# EasyEDA Pro project ProPrj_NFC Buisness card_2026-06-10_16-38-08_2026-06-10.epro

# Schematic NFC Buisness card
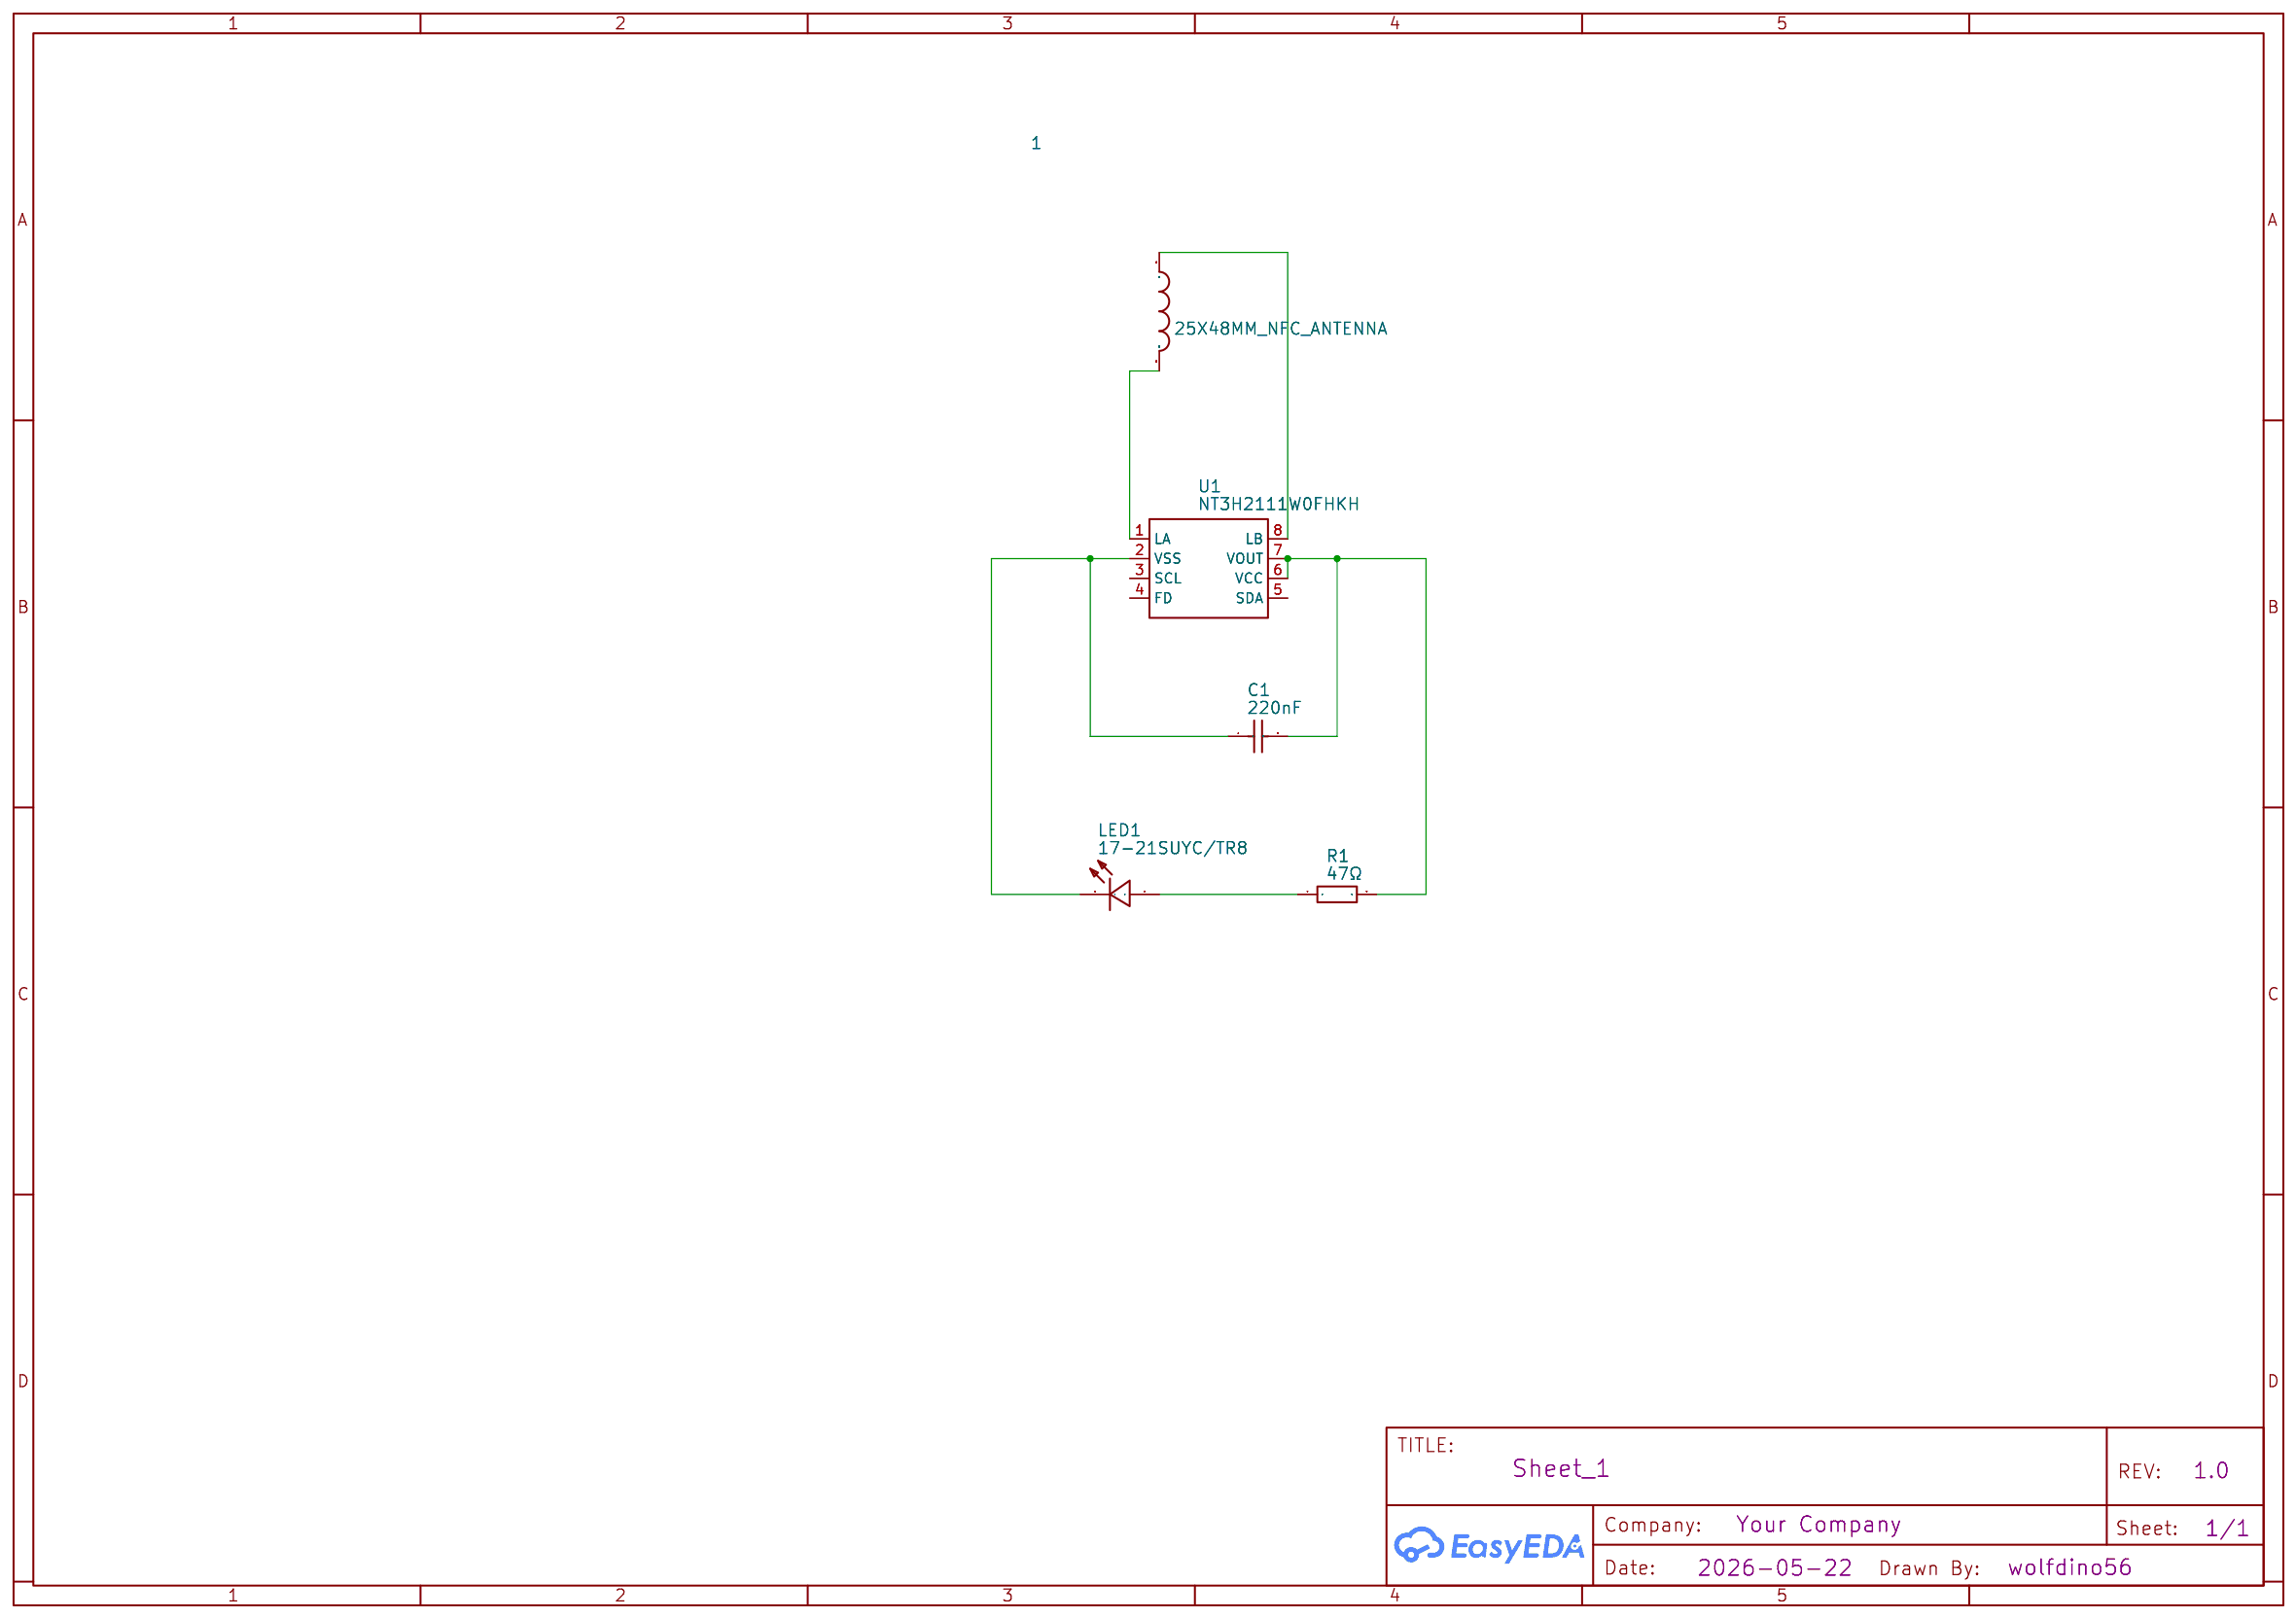
[diagram p0: schematic sheet]

## Parts
1  25X48MM_NFC_ANTENNA  [25X48MM_NFC_ANTENNA]
C1  220nF  [C0603]
LED1  17-21SUYC/TR8  [LED0805-R-RD]
R1  47Ω  [R0603]
U1  NT3H2111W0FHKH  [XQFN-8_L1.6-W1.6-P0.50-BL_NT3H2111W0FHKH]

## Library data of the parts
1 = 25X48MM_NFC_ANTENNA
C1 = CL10B224KA8NNNC: Supplier: LCSC; Manufacturer: SAMSUNG(三星); Supplier Part: C21120; JLCPCB Part Class: Basic Part; Origin 3D Model Title: C0603_L1.6-W0.8-H0.8
LED1 = KT-0805黄灯: Supplier: LCSC; Manufacturer: KENTO; Supplier Part: C2296; JLCPCB Part Class: Basic Part; Origin 3D Model Title: LED0805-RD
R1 = 0603WAF470JT5E: Supplier: LCSC; Manufacturer: UNI-ROYAL(厚声); Supplier Part: C23182; JLCPCB Part Class: Basic Part
U1 = NT3H2111W0FHKH: Supplier: LCSC; Supplier Part: C710403; Manufacturer: NXP(恩智浦); JLCPCB Part Class: Extended Part

## Nets
LED1_1: LED1.1(+) R1.1
U1_1: 1.P$2 U1.1(LA)
U1_2: C1.1 LED1.2(-) U1.2(VSS)
U1_6: C1.2 R1.2 U1.6(VCC) U1.7(VOUT)
U1_8: 1.P$1 U1.8(LB)

Not connected (* = marked no-connect by the designer): U1 3(SCL) 4(FD) 5(SDA)

# Board PCB_NFC Buisness card
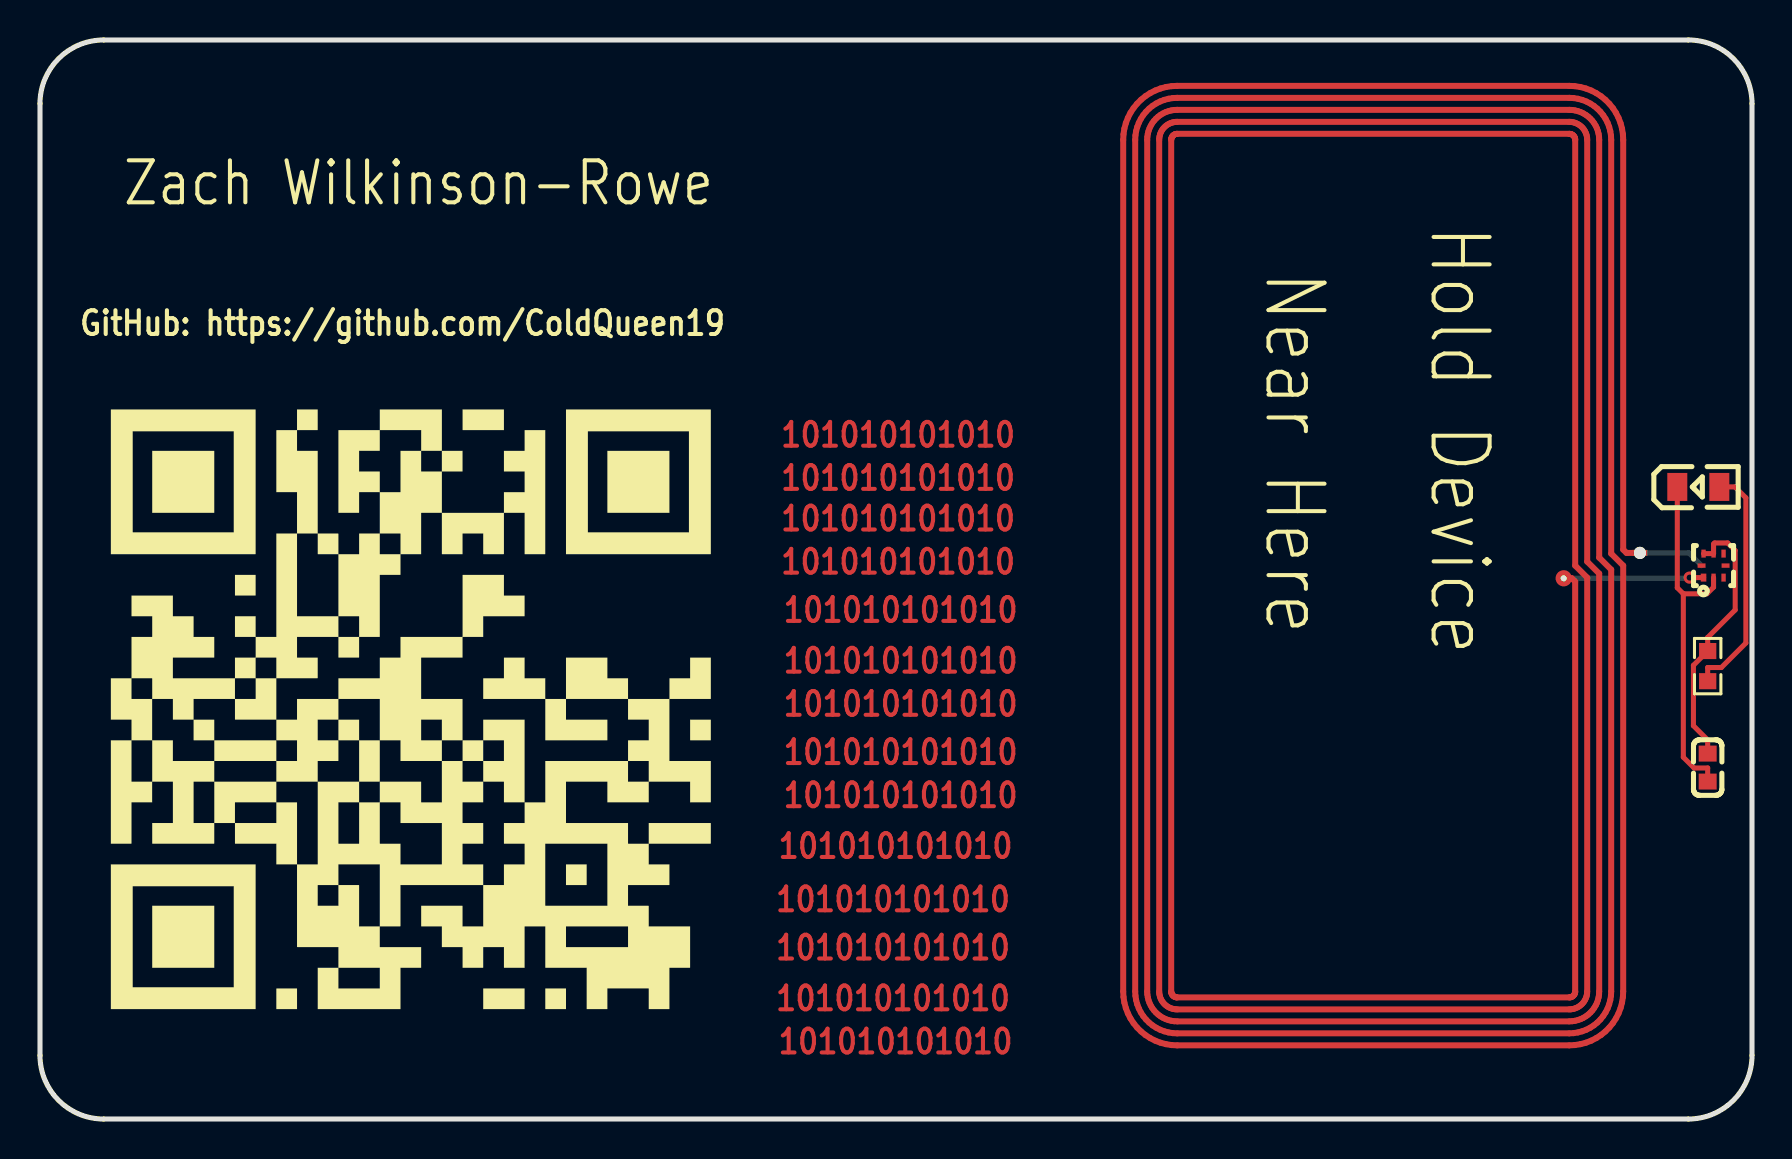
[diagram p1: board, top side]
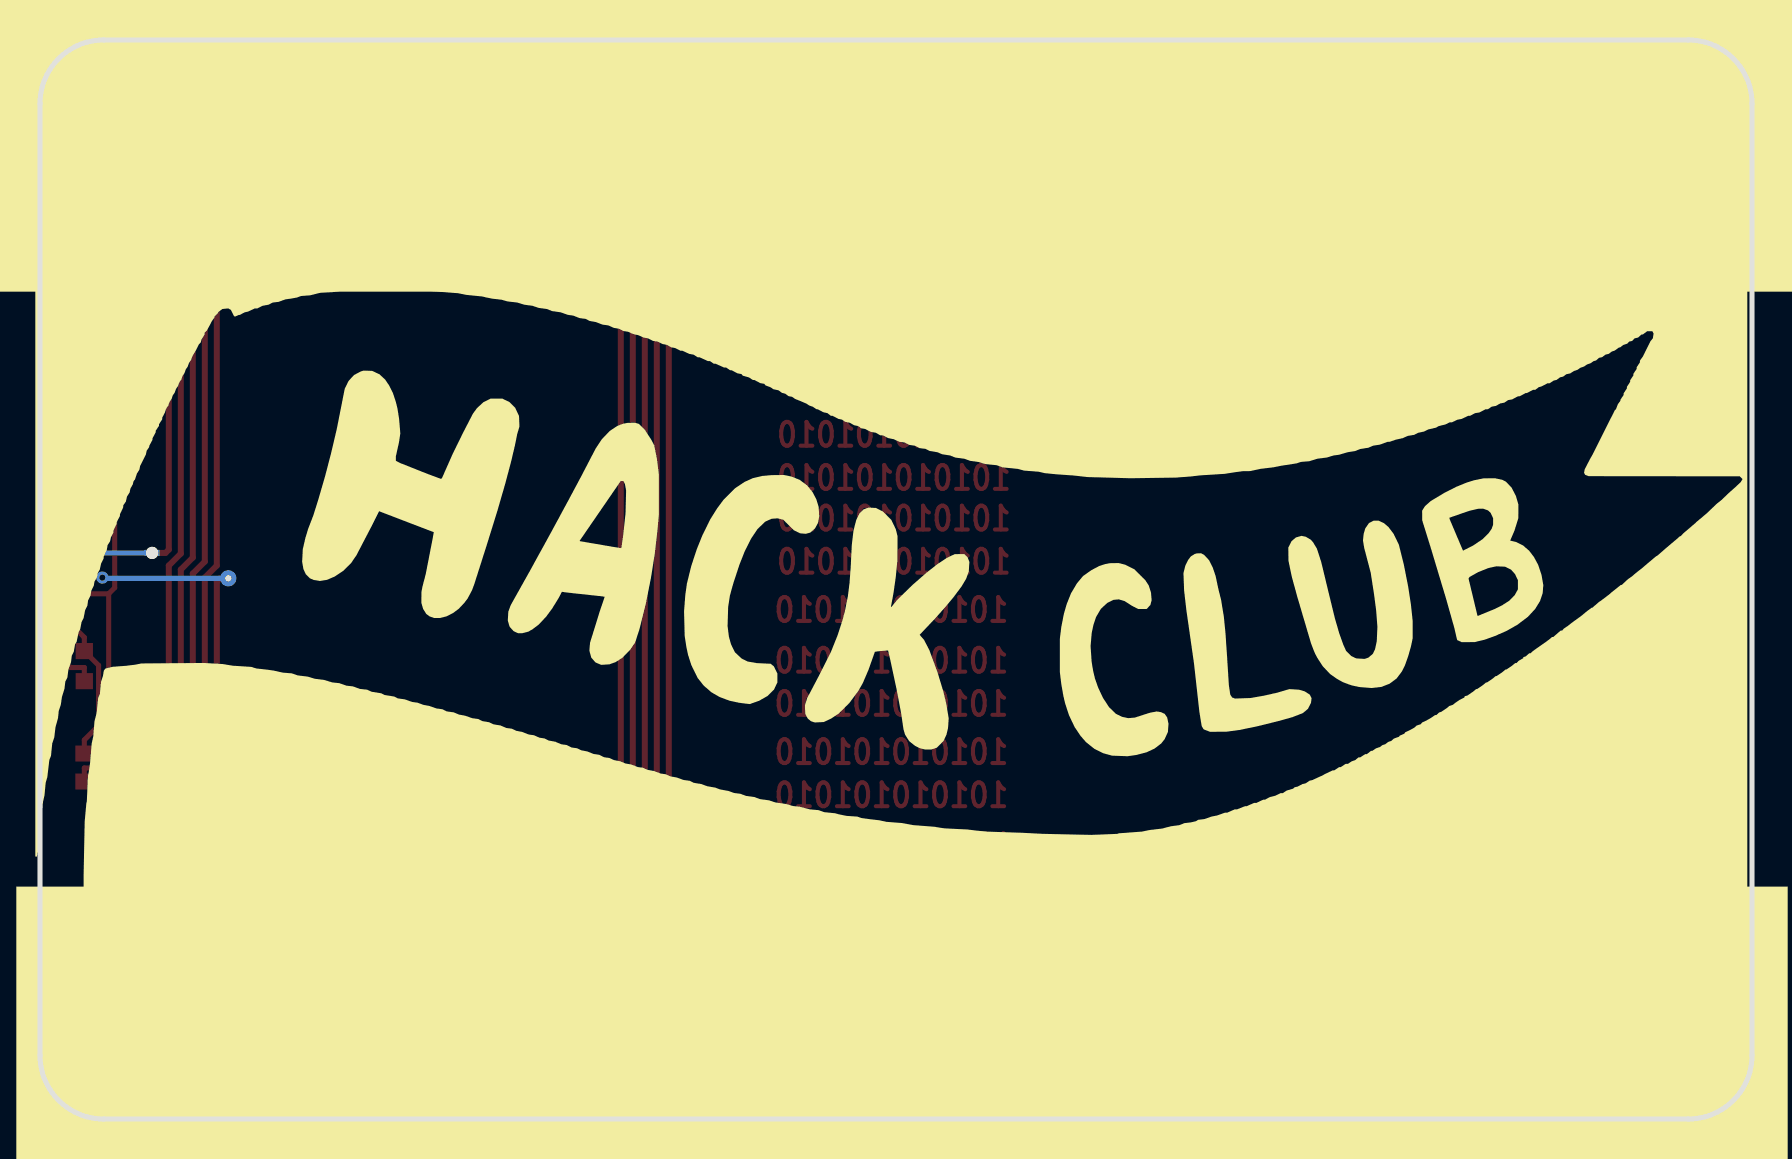
[diagram p2: board, bottom side, seen from below]

Outline 85.6 x 53.98 mm; copper layers: Top Layer, Bottom Layer. Coordinates in mm from the lower left corner of the outline.
Outline path: 0,50.8 arc(0.93,53.05) 3.18,53.98 82.42,53.98 arc(84.67,53.05) 85.6,50.8 85.6,3.18 arc(84.67,0.93) 82.42,0 3.18,0 arc(0.93,0.93) 0,3.18 0,50.8
Stack: Top Layer 0.035mm / Bottom Layer 0.035mm

## Design rules (mm)
spacing Default (default): track to track 0.102, other pairs 0 to 0.3
track width Default (default): min 0.254, default 0.254, max 25.4
differential pair differentialPair (default): width min 0.127, default 2.54, max 2.54; gap min 0.127, default 0.152

## Placement (name value [footprint] x y rotation side)
1  -  [25X48MM_NFC_ANTENNA]  66.66 27.69 270 top
C1  220nF  [C0603]  83.38 17.58 90 top
LED1  17-21SUYC/TR8  [LED0805-R-RD]  82.92 31.62 0 top
R1  47Ω  [R0603]  83.38 22.66 90 top
U1  NT3H2111W0FHKH  [XQFN-8_L1.6-W1.6-P0.50-BL_NT3H2111W0FHKH]  83.68 27.69 90 top

## Footprints (pads in the part's own frame, mm; a bottom-side part is the same pattern mirrored in y, then rotated)
25X48MM_NFC_ANTENNA
  rect 0.3x0.75 hole 0.61: P$1(-0.635,13.335)
  round 0.808 hole 0.3x0.3: P$2(0.635,9.525)
C0603
  rect 0.8x0.9 smd: 1(-0.7,0) 2(0.7,0)
LED0805-R-RD
  rect 1x1.399 smd: 1(1.05,0) 2(-1.05,0)
R0603
  rect 0.806x0.864 smd: 1(-0.753,0) 2(0.753,0)
XQFN-8_L1.6-W1.6-P0.50-BL_NT3H2111W0FHKH
  rect 0.4x0.28 smd: 1(-0.6,0.5)
  rect 0.4x0.22 smd: 2(-0.6,0) 3(-0.6,-0.5) 5(0.6,-0.5) 6(0.6,0) 7(0.6,0.5)
  rect 0.22x0.4 smd: 4(0,-0.6) 8(0,0.6)

## Nets
As in the schematic.

## Via types
v1: diameter 0.61, hole 0.305, Top Layer to Bottom Layer, 1 via

## Routing (per net, layer and track width the routed paths; a pad name or vN(x,y) marks a point on that pad's centre or on a via; arc(x,y) is an arc through that point)
LED1_1: length 11.9
  Top Layer w0.254: 83.97,31.62 84.75,31.62 85.29,31.07 85.29,23.81 84.07,22.59 83.38,22.59 R1.1
U1_1: length 28.6
  Top Layer w0.254: 76.19,27.05 76.59,27.05 76.76,26.88 76.76,6.39 76.76,6.36 76.76,6.34 76.75,6.31 76.74,6.29 76.73,6.27 76.72,6.24 76.71,6.22 76.7,6.2 76.68,6.18 76.66,6.17 76.65,6.15 76.63,6.13 76.6,6.12 76.58,6.11 76.56,6.1 76.54,6.09 76.51,6.09 76.49,6.09 76.46,6.09 ; U1.1 v1(82.48,27.09)
  Bottom Layer w0.254: v1(82.48,27.09) 82.45,27.05 76.19,27.05
U1_2: length 17.9
  Top Layer w0.254: C1.1 83.38,17.56 82.7,17.56 82.17,18.1 82.17,26.28 ; 82.17,26.28 83.35,26.28 83.68,26.61 U1.2 ; 82.17,26.28 81.87,26.58 81.87,31.62
U1_6: length 13.6
  Top Layer w0.254: U1.7 U1.6 83.68,28.77 83.73,28.82 84.38,28.82 84.76,28.44 84.76,25.47 83.38,24.09 83.38,23.41 82.67,22.7 82.67,19.67 83.38,18.96 C1.2
U1_8: length 3.3
  Bottom Layer w0.254: U1.8 82.44,28.32 1.P$1

## Text on the board
Top Layer: 101010101010
Top Solder Mask Layer: 101010101010
Top Silkscreen Layer: GitHub: https://github.com/ColdQueen19 | Zach Wilkinson-Rowe | Near Here | Hold Device
